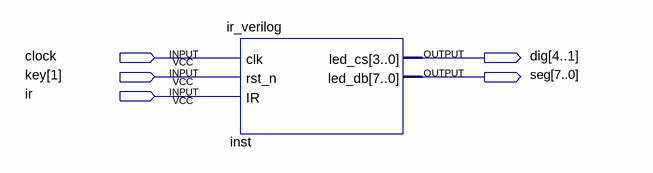
[diagram p0: schematic sheet]
// Quartus schematic top_entity.bdf as structural Verilog: 1 symbols, 5 pins
module top_entity (
  input  clock,
  input  [1:1] key,
  input  ir,
  output [4:1] dig,
  output [7:0] seg
);

  ir_verilog inst (.clk(clock), .rst_n(key[1]), .IR(ir), .led_cs(dig), .led_db(seg));
endmodule
